# Altium schematic sheet Current_Amplifier_Shematics.SchDoc
size A4
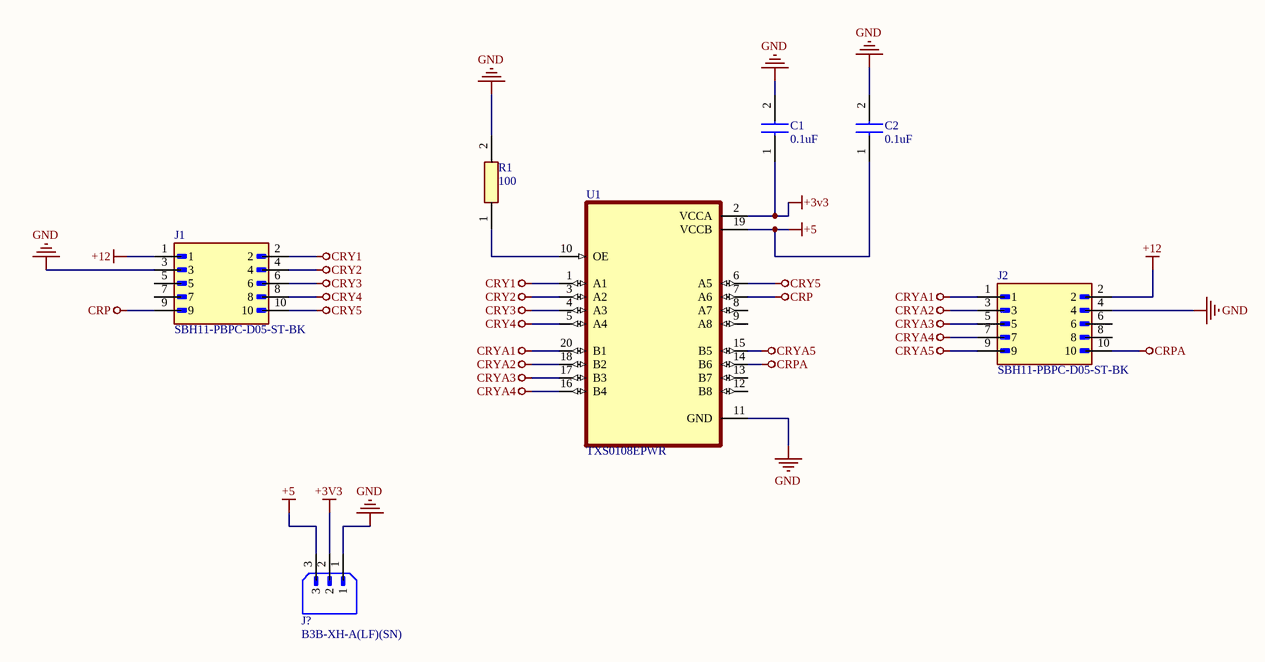
[diagram p0: Current_Amplifier_Shematics.SchDoc]

## Parts
C1  0.1uF  [CAPC2013X140N]
C2  0.1uF  [CAPC2013X140N]
J1  SBH11-PBPC-D05-ST-BK  [SULLINS_SBH11-PBPC-D05-ST-BK]
J2  SBH11-PBPC-D05-ST-BK  [SULLINS_SBH11-PBPC-D05-ST-BK]
J?  B3B-XH-A(LF)(SN)  [JST_B3B-XH-A(LF)(SN)]
R1  100  [RESC2012X65N]
U1  TXS0108EPWR  [SOP65P640X120-20N]

## Nets
+3v3: C1.1(C1) J?.2 U1.2(VCCA)
+5: C2.1(C1) J?.3 U1.19(VCCB)
+12: J1.1 J2.2
CRP: J1.9 U1.7(A6)
CRPA: J2.10 U1.14(B6)
CRY1: J1.2 U1.1(A1)
CRY2: J1.4 U1.3(A2)
CRY3: J1.6 U1.4(A3)
CRY4: J1.8 U1.5(A4)
CRY5: J1.10 U1.6(A5)
CRYA1: J2.1 U1.20(B1)
CRYA2: J2.3 U1.18(B2)
CRYA3: J2.5 U1.17(B3)
CRYA4: J2.7 U1.16(B4)
CRYA5: J2.9 U1.15(B5)
GND: C1.2(C2) C2.2(C2) J1.3 J2.4 J?.1 R1.2 U1.11(GND)
NetR1_1: R1.1 U1.10(OE)

Not connected (* = marked no-connect by the designer): J1 5 7; J2 6 8; U1 8(A7) 9(A8) 12(B8) 13(B7)

## Library data of the parts
C1 C2 = 08053C474JAT2A: Capacitor; Manufacturer_Name: Kyocera AVX; Manufacturer_Part_Number: 08053C474JAT2A; Mouser Part Number: 581-08053C474JAT2A; Mouser Price/Stock: https://www.mouser.co.uk/ProductDetail/KYOCERA-AVX/08053C474JAT2A?qs=bb%252B1MDm7h6L8wnHciIrwGg%3D%3D
J1 J2 = SBH11-PBPC-D05-ST-BK: 10 Position Total Dual Row 2.54 mm Pitch Straight Male Shrouded Box Header; MF: Sullins Connector; SnapEDA_Link: https://www.snapeda.com/parts/SBH11-PBPC-D05-ST-BK/Sullins+Connector+Solutions/view-part/?ref=snap; Package: None; Value: *; MP: SBH11-PBPC-D05-ST-BK; Check_prices: https://www.snapeda.com/parts/SBH11-PBPC-D05-ST-BK/Sullins+Connector+Solutions/view-part/?ref=eda
J? = B3B-XH-A(LF)(SN): Connector Header Through Hole 3 position 0.098 (2.50mm); MF: JST Sales; SnapEDA_Link: https://www.snapeda.com/parts/B3B-XH-A(LF)(SN)/JST+Sales+America+Inc./view-part/?ref=snap; Package: None; Value: *; MP: B3B-XH-A(LF)(SN); Check_prices: https://www.snapeda.com/parts/B3B-XH-A(LF)(SN)/JST+Sales+America+Inc./view-part/?ref=eda
R1 = CPF0805B102RE1: Resistor; Manufacturer_Name: TE Connectivity; Datasheet Link: http://docs-europe.electrocomponents.com/webdocs/13d1/0900766b813d116f.pdf; Height: 0.65mm; Manufacturer_Part_Number: CPF0805B102RE1
U1 = TXS0108EPWR: 8-bit bidirectional voltage-level shifter for open-drain and push-pull application; MF: Texas Instruments; Value: *; SnapEDA_Link: https://www.snapeda.com/parts/TXS0108EPWR/Texas+Instruments/view-part/?ref=snap; Purchase-URL: https://pricing.snapeda.com/search/part/TXS0108EPWR/?ref=eda; Availability: In Stock; Price: None; Package: TSSOP-20 Texas Instruments; Check_prices: https://www.snapeda.com/parts/TXS0108EPWR/Texas+Instruments/view-part/?ref=eda; MP: TXS0108EPWR